# Altium schematic sheet RAM & MAR Circuit Electronic Scheme_2021-12-04.schdoc
size 910 x 236 mm
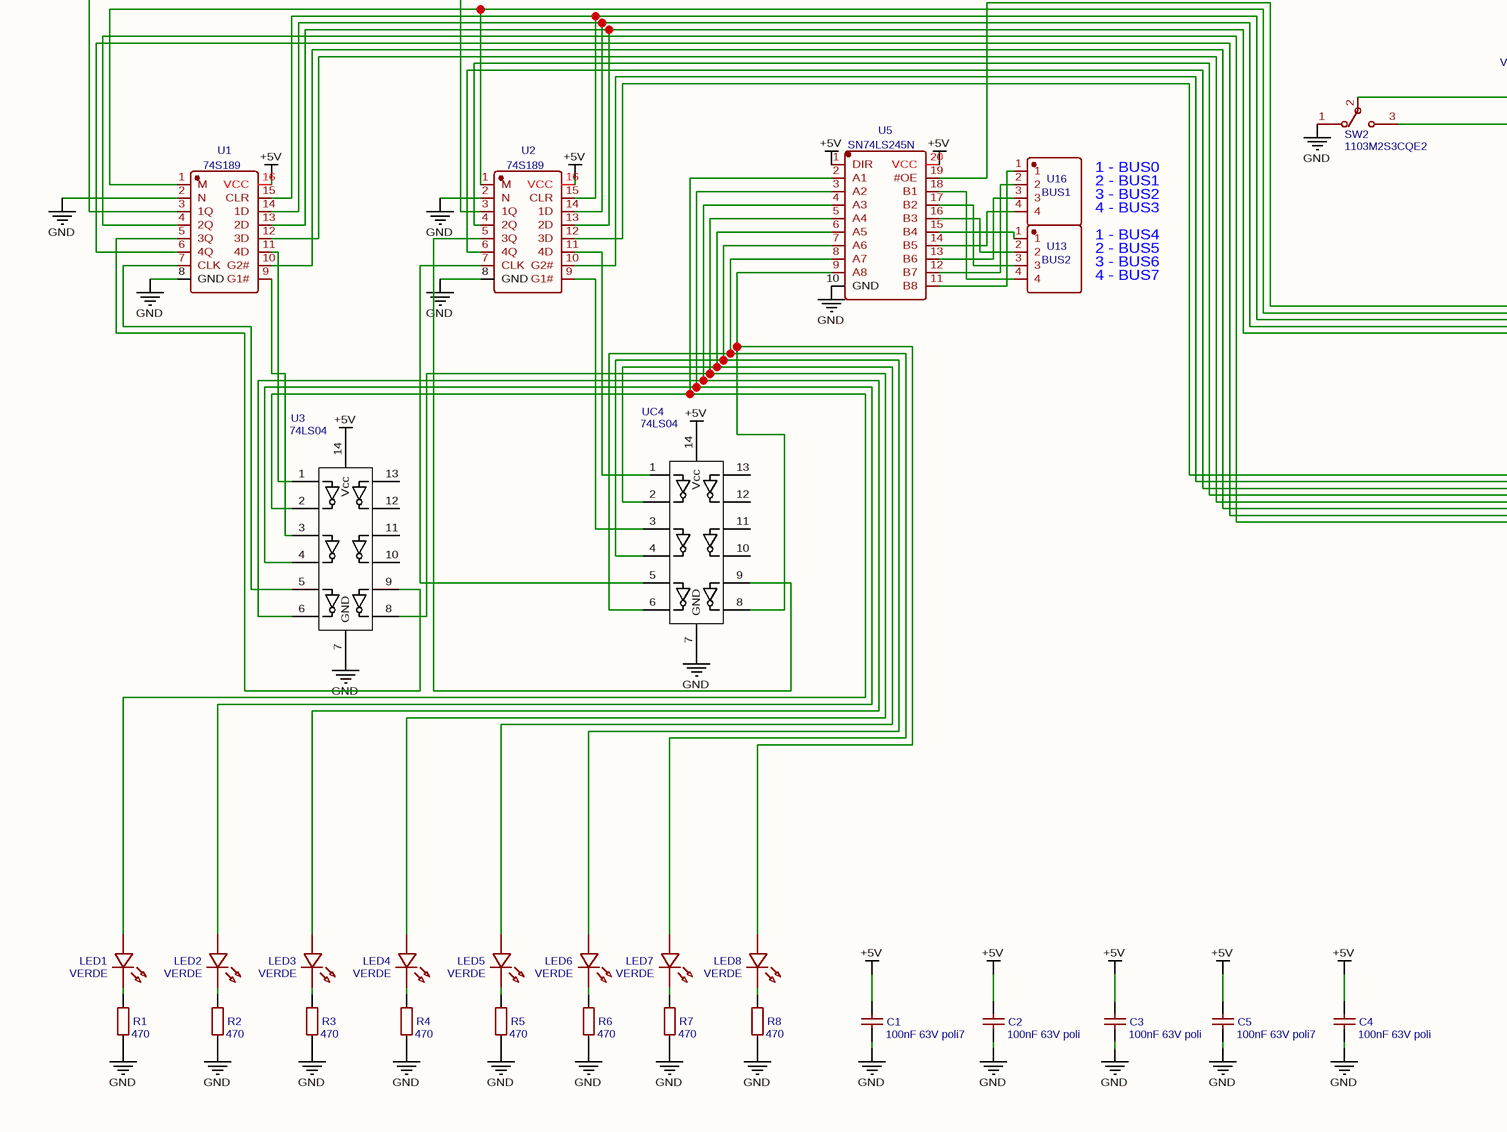
[diagram p0: RAM & MAR Circuit Electronic Scheme_2021-12-04.schdoc, left]
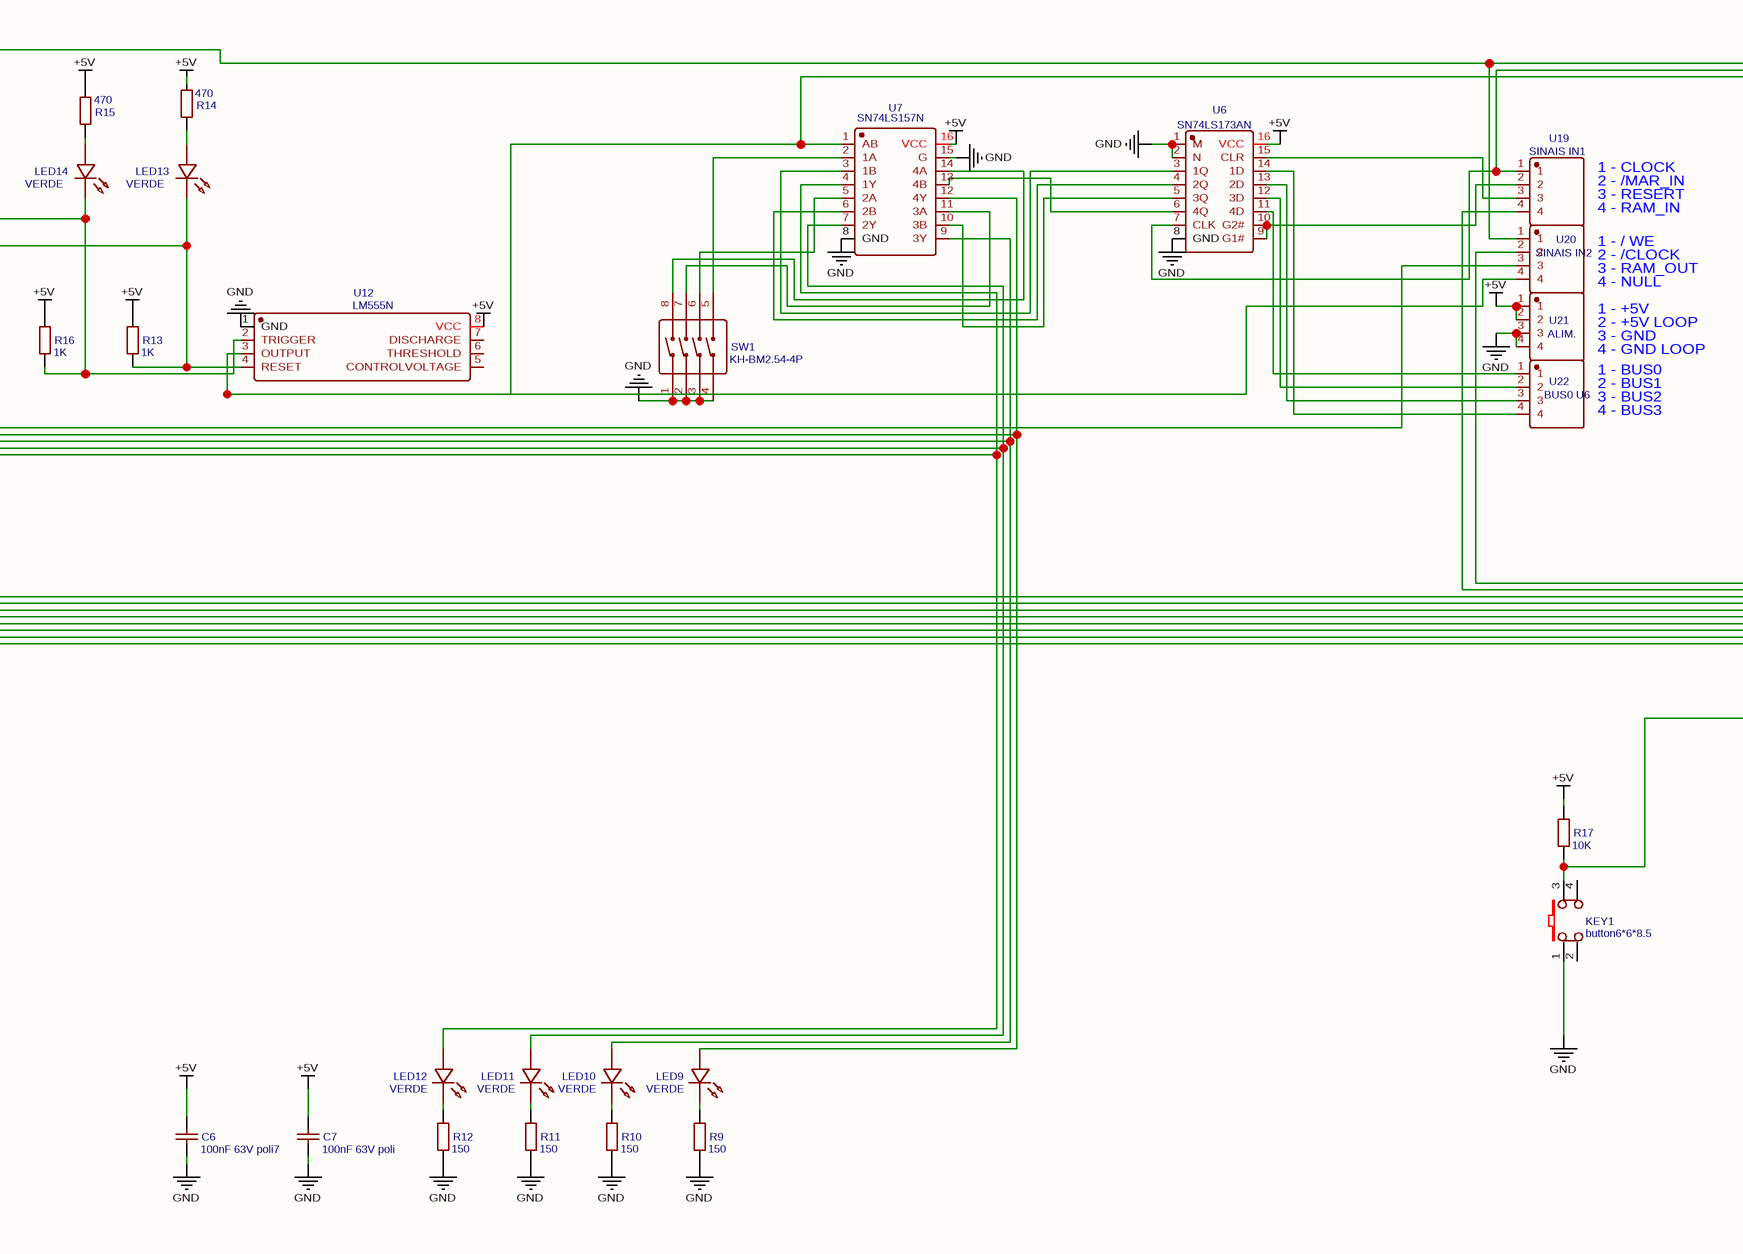
[diagram p1: RAM & MAR Circuit Electronic Scheme_2021-12-04.schdoc, middle]
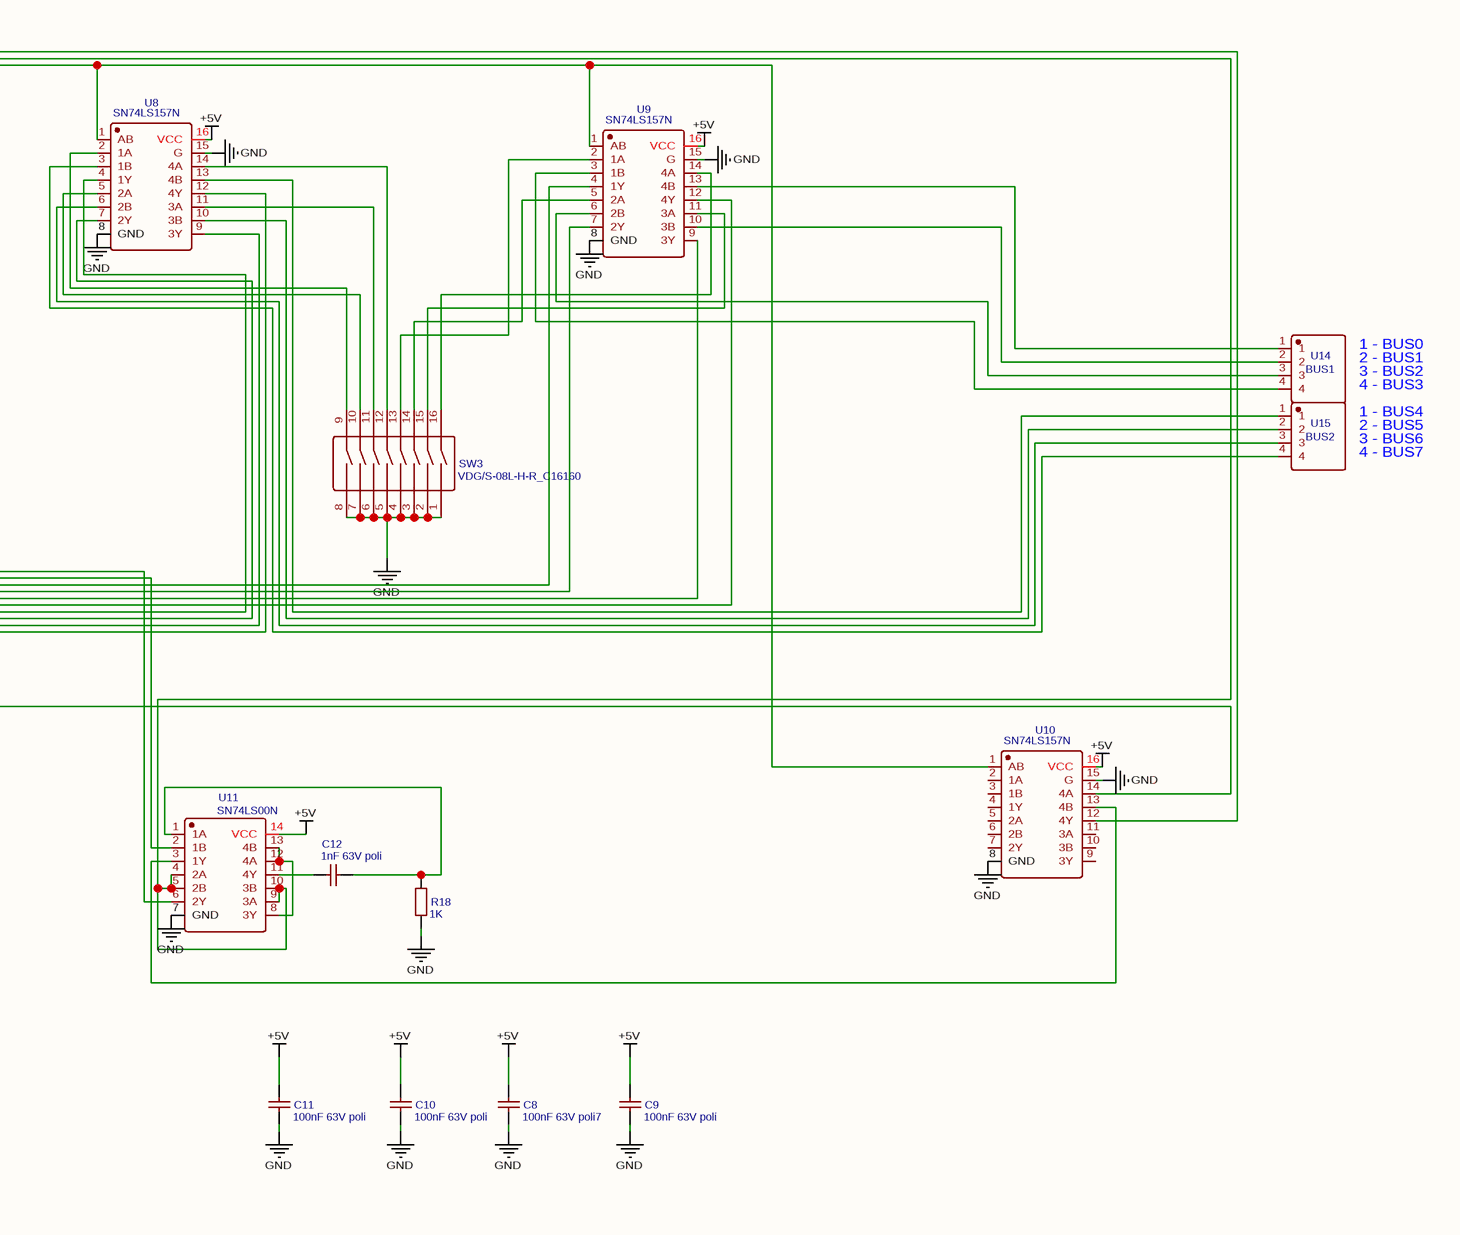
[diagram p2: RAM & MAR Circuit Electronic Scheme_2021-12-04.schdoc, right]

## Parts
C1  100nF 63V poli7  [CAP-TH_L7.6-W3.8-P5.08-D0.51]
C2  100nF 63V poli  [CAP-TH_L7.6-W3.8-P5.08-D0.51]
C3  100nF 63V poli  [CAP-TH_L7.6-W3.8-P5.08-D0.51]
C4  100nF 63V poli  [CAP-TH_L7.6-W3.8-P5.08-D0.51]
C5  100nF 63V poli7  [CAP-TH_L7.6-W3.8-P5.08-D0.51]
C6  100nF 63V poli7  [CAP-TH_L7.6-W3.8-P5.08-D0.51]
C7  100nF 63V poli  [CAP-TH_L7.6-W3.8-P5.08-D0.51]
C8  100nF 63V poli7  [CAP-TH_L7.6-W3.8-P5.08-D0.51]
C9  100nF 63V poli  [CAP-TH_L7.6-W3.8-P5.08-D0.51]
C10  100nF 63V poli  [CAP-TH_L7.6-W3.8-P5.08-D0.51]
C11  100nF 63V poli  [CAP-TH_L7.6-W3.8-P5.08-D0.51]
C12  1nF 63V poli  [CAP-TH_L7.6-W3.8-P5.08-D0.51]
KEY1  button6*6*8.5  [KEY-TH_4P-L6.0-W6.0-P4.50]
LED1  VERDE  [LED-TH_BD3.0-P2.54-RD-GREEN]
LED2  VERDE  [LED-TH_BD3.0-P2.54-RD-GREEN]
LED3  VERDE  [LED-TH_BD3.0-P2.54-RD-GREEN]
LED4  VERDE  [LED-TH_BD3.0-P2.54-RD-GREEN]
LED5  VERDE  [LED-TH_BD3.0-P2.54-RD-GREEN]
LED6  VERDE  [LED-TH_BD3.0-P2.54-RD-GREEN]
LED7  VERDE  [LED-TH_BD3.0-P2.54-RD-GREEN]
LED8  VERDE  [LED-TH_BD3.0-P2.54-RD-GREEN]
LED9  VERDE  [LED-TH_BD3.0-P2.54-RD-GREEN]
LED10  VERDE  [LED-TH_BD3.0-P2.54-RD-GREEN]
LED11  VERDE  [LED-TH_BD3.0-P2.54-RD-GREEN]
LED12  VERDE  [LED-TH_BD3.0-P2.54-RD-GREEN]
LED13  VERDE  [LED-TH_BD3.0-P2.54-RD-GREEN]
LED14  VERDE  [LED-TH_BD3.0-P2.54-RD-GREEN]
R1  470  [RES-TH_BD3.0-L9.5-P13.50-D0.6]
R2  470  [RES-TH_BD3.0-L9.5-P13.50-D0.6]
R3  470  [RES-TH_BD3.0-L9.5-P13.50-D0.6]
R4  470  [RES-TH_BD3.0-L9.5-P13.50-D0.6]
R5  470  [RES-TH_BD3.0-L9.5-P13.50-D0.6]
R6  470  [RES-TH_BD3.0-L9.5-P13.50-D0.6]
R7  470  [RES-TH_BD3.0-L9.5-P13.50-D0.6]
R8  470  [RES-TH_BD3.0-L9.5-P13.50-D0.6]
R9  150  [RES-TH_BD3.0-L9.5-P13.50-D0.6]
R10  150  [RES-TH_BD3.0-L9.5-P13.50-D0.6]
R11  150  [RES-TH_BD3.0-L9.5-P13.50-D0.6]
R12  150  [RES-TH_BD3.0-L9.5-P13.50-D0.6]
R13  1K  [RES-TH_BD3.0-L9.5-P13.50-D0.6]
R14  470  [RES-TH_BD3.0-L9.5-P13.50-D0.6]
R15  470  [RES-TH_BD3.0-L9.5-P13.50-D0.6]
R16  1K  [RES-TH_BD3.0-L9.5-P13.50-D0.6]
R17  10K  [RES-TH_BD3.0-L9.5-P13.50-D0.6]
R18  1K  [RES-TH_BD3.0-L9.5-P13.50-D0.6]
SW1  KH-BM2.54-4P  [SW-TH_KH-BM2.54-4P]
SW2  1103M2S3CQE2  [SW-TH_1103M2S3CQE2]
SW3  VDG/S-08L-H-R_C16160  [SW-TH_VDG-08LG-R]
U1  74S189  [PDIP-16_L19.7-W6.6-P2.54-LS7.6-BL]
U2  74S189  [PDIP-16_L19.7-W6.6-P2.54-LS7.6-BL]
U3  74LS04  [DIL-14]
U5  SN74LS245N  [DIP-20_L25.5-W10.0-P2.54-LS7.6-BL]
U6  SN74LS173AN  [PDIP-16_L19.7-W6.6-P2.54-LS7.6-BL]
U7  SN74LS157N  [DIP-16_16P-L20.2-W6.6-P2.54-LS7.6-BL]
U8  SN74LS157N  [DIP-16_16P-L20.2-W6.6-P2.54-LS7.6-BL]
U9  SN74LS157N  [DIP-16_16P-L20.2-W6.6-P2.54-LS7.6-BL]
U10  SN74LS157N  [DIP-16_16P-L20.2-W6.6-P2.54-LS7.6-BL]
U11  SN74LS00N  [PDIP-14_L19.7-W6.6-P2.54-LS8.3-BL]
U12  LM555N  [DIP-8_L9.7-W6.4-P2.54-LS7.6-BL]
U13  BUS2  [HDR-TH_4P-P2.54-D1.0]
U14  BUS1  [HDR-TH_4P-P2.54-D1.0]
U15  BUS2  [HDR-TH_4P-P2.54-D1.0]
U16  BUS1  [HDR-TH_4P-P2.54-D1.0]
U19  SINAIS IN1  [HDR-TH_4P-P2.54-D1.0]
U20  SINAIS IN2  [HDR-TH_4P-P2.54-D1.0]
U21  ALIM.  [HDR-TH_4P-P2.54-D1.0]
U22  BUS0 U6  [HDR-TH_4P-P2.54-D1.0]
UC4  74LS04  [DIL-14]

## Nets
+5V: C1.1 C2.1 C3.1 C4.1 C5.1 C6.1 C7.1 C8.1 C9.1 C10.1 C11.1 R13.1 R14.2 R15.2 R16.1 R17.1 U1.16(VCC) U2.16(VCC) U3.14(Vcc) U5.1(DIR) U5.20(VCC) U6.16(VCC) U7.16(VCC) U8.16(VCC) U9.16(VCC) U10.16(VCC) U11.14(VCC) U12.8(VCC) U21.1 U21.2 UC4.14(Vcc)
GND: C1.2 C2.2 C3.2 C4.2 C5.2 C6.2 C7.2 C8.2 C9.2 C10.2 C11.2 KEY1.1 R1.2 R2.2 R3.2 R4.2 R5.2 R6.2 R7.2 R8.2 R9.2 R10.2 R11.2 R12.2 R18.2 SW1.1 SW1.2 SW1.3 SW1.4 SW2.1 SW3.1 SW3.2 SW3.3 SW3.4 SW3.5 SW3.6 SW3.7 SW3.8 U1.2(N) U1.8(GND) U2.2(N) U2.8(GND) U3.7(GND) U5.10(GND) U6.1(M) U6.2(N) U6.8(GND) U7.8(GND) U7.15(G) U8.8(GND) U8.15(G) U9.8(GND) U9.15(G) U10.8(GND) U10.15(G) U11.7(GND) U12.1(GND) U21.3 U21.4 UC4.7(GND)
NetC12_1: C12.1 U11.11(4Y)
NetC12_2: C12.2 R18.1 U11.1(1A)
NetKEY1_3: KEY1.3 R17.2 U10.14(4A)
NetLED1_1: LED1.1(-) R1.1
NetLED1_2: LED1.2(+) U3.2 U5.2(A1)
NetLED2_1: LED2.1(-) R2.1
NetLED2_2: LED2.2(+) U3.4 U5.3(A2)
NetLED3_1: LED3.1(-) R3.1
NetLED3_2: LED3.2(+) U3.6 U5.4(A3)
NetLED4_1: LED4.1(-) R4.1
NetLED4_2: LED4.2(+) U3.8 U5.5(A4)
NetLED5_1: LED5.1(-) R5.1
NetLED5_2: LED5.2(+) U5.6(A5) UC4.2
NetLED6_1: LED6.1(-) R6.1
NetLED6_2: LED6.2(+) U5.7(A6) UC4.4
NetLED7_1: LED7.1(-) R7.1
NetLED7_2: LED7.2(+) U5.8(A7) UC4.6
NetLED8_1: LED8.1(-) R8.1
NetLED8_2: LED8.2(+) U5.9(A8) UC4.8
NetLED9_1: LED9.1(-) R9.1
NetLED9_2: LED9.2(+) U1.1(M) U2.1(M) U7.12(4Y)
NetLED10_1: LED10.1(-) R10.1
NetLED10_2: LED10.2(+) U1.15(CLR) U2.15(CLR) U7.9(3Y)
NetLED11_1: LED11.1(-) R11.1
NetLED11_2: LED11.2(+) U1.14(1D) U2.14(1D) U7.7(2Y)
NetLED12_1: LED12.1(-) R12.1
NetLED12_2: LED12.2(+) U1.13(2D) U2.13(2D) U7.4(1Y)
NetLED13_1: LED13.1(-) R13.2 SW2.3 U12.4(RESET)
NetLED13_2: LED13.2(+) R14.1
NetLED14_1: LED14.1(-) R16.2 SW2.2 U12.2(TRIGGER)
NetLED14_2: LED14.2(+) R15.1
NetSW1_5: SW1.5 U7.2(1A)
NetSW1_6: SW1.6 U7.5(2A)
NetSW1_7: SW1.7 U7.11(3A)
NetSW1_8: SW1.8 U7.14(4A)
NetSW3_9: SW3.9 U8.2(1A)
NetSW3_10: SW3.10 U8.5(2A)
NetSW3_11: SW3.11 U8.11(3A)
NetSW3_12: SW3.12 U8.14(4A)
NetSW3_13: SW3.13 U9.2(1A)
NetSW3_14: SW3.14 U9.5(2A)
NetSW3_15: SW3.15 U9.11(3A)
NetSW3_16: SW3.16 U9.14(4A)
NetU1_3: U1.3(1Q) U2.3(1Q) U10.12(4Y) U20.1
NetU1_4: U1.4(2Q) U8.12(4Y)
NetU1_5: U1.5(3Q) U3.9
NetU1_6: U1.6(4Q) U8.9(3Y)
NetU1_7: U1.7(CLK) U3.5
NetU1_9: U1.9(G1#) U3.3
NetU1_10: U1.10(G2#) U8.7(2Y)
NetU1_11: U1.11(4D) U3.1
NetU1_12: U1.12(3D) U8.4(1Y)
NetU2_4: U2.4(2Q) U9.12(4Y)
NetU2_5: U2.5(3Q) UC4.9
NetU2_6: U2.6(4Q) U9.9(3Y)
NetU2_7: U2.7(CLK) UC4.5
NetU2_9: U2.9(G1#) UC4.3
NetU2_10: U2.10(G2#) U9.7(2Y)
NetU2_11: U2.11(4D) UC4.1
NetU2_12: U2.12(3D) U9.4(1Y)
NetU5_11: U5.11(B8) U16.1
NetU5_12: U5.12(B7) U16.2
NetU5_13: U5.13(B6) U16.3
NetU5_14: U5.14(B5) U16.4
NetU5_15: U5.15(B4) U13.1
NetU5_16: U5.16(B3) U13.2
NetU5_17: U5.17(B2) U13.3
NetU5_18: U5.18(B1) U13.4
NetU5_19: U5.19(#OE) U20.3
NetU6_3: U6.3(1Q) U7.3(1B)
NetU6_4: U6.4(2Q) U7.6(2B)
NetU6_5: U6.5(3Q) U7.10(3B)
NetU6_6: U6.6(4Q) U7.13(4B)
NetU6_7: U6.7(CLK) U11.4(2A) U11.5(2B) U11.9(3A) U11.10(3B) U19.1
NetU6_9: U6.9(G1#) U6.10(G2#) U19.2
NetU6_11: U6.11(4D) U22.1
NetU6_12: U6.12(3D) U22.2
NetU6_13: U6.13(2D) U22.3
NetU6_14: U6.14(1D) U22.4
NetU6_15: U6.15(CLR) U19.3
NetU7_1: U7.1(AB) U8.1(AB) U9.1(AB) U10.1(AB) U12.3(OUTPUT) U20.4
NetU8_3: U8.3(1B) U15.4
NetU8_6: U8.6(2B) U15.3
NetU8_10: U8.10(3B) U15.2
NetU8_13: U8.13(4B) U15.1
NetU9_3: U9.3(1B) U14.4
NetU9_6: U9.6(2B) U14.3
NetU9_10: U9.10(3B) U14.2
NetU9_13: U9.13(4B) U14.1
NetU10_13: U10.13(4B) U11.3(1Y)
NetU11_2: U11.2(1B) U19.4
NetU11_6: U11.6(2Y) U20.2
NetU11_8: U11.8(3Y) U11.12(4A) U11.13(4B)

Not connected (* = marked no-connect by the designer): KEY1 2 4; U3 10 11 12 13; U10 2(1A) 3(1B) 4(1Y) 5(2A) 6(2B) 7(2Y) 9(3Y) 10(3B) 11(3A); U12 5(CONTROLVOLTAGE) 6(THRESHOLD) 7(DISCHARGE); UC4 10 11 12 13

## Notes on the sheet
- 3 - RESERT
- 2 - /MAR_IN
- 1 - CLOCK
- 4 - RAM_IN
- 1 - / WE
- 2 - /CLOCK
- 4 - BUS3
- 3 - BUS2
- 1 - BUS0
- 2 - BUS1
- 1 - +5V
- 2 - +5V LOOP
- 3 - RAM_OUT
- 4 - NULL
- 2 - BUS5
- 1 - BUS4
- 3 - BUS6
- 4 - BUS7
- 3 - GND
- 4 - GND LOOP

## Library data of the parts
C1 C5 C6 C8 = 100nF 63V poli7: BOM_Manufacturer: AVX; BOM_Manufacturer Part: SR305C105KAR; nameAlias: Capacitance; Contributor: LCSC; BOM_Supplier: LCSC; BOM_Supplier Part: C444741; BOM_JLCPCB Part Class: Extended Part; spicePre: C; spiceSymbolName: SR305C105KAR
C2-C4 C7 C9-C11 = 100nF 63V poli: BOM_Manufacturer: AVX; BOM_Manufacturer Part: SR305C105KAR; nameAlias: Capacitance; Contributor: LCSC; BOM_Supplier: LCSC; BOM_Supplier Part: C444741; BOM_JLCPCB Part Class: Extended Part; spicePre: C; spiceSymbolName: SR305C105KAR
C12 = 1nF 63V poli: BOM_Manufacturer: AVX; BOM_Manufacturer Part: SR305C105KAR; nameAlias: Capacitance; Contributor: LCSC; BOM_Supplier: LCSC; BOM_Supplier Part: C444741; BOM_JLCPCB Part Class: Extended Part; spicePre: C; spiceSymbolName: SR305C105KAR
KEY1 = button6*6*8.5: BOM_Manufacturer: ReliaPro; BOM_Supplier Part: C59980; BOM_Supplier: LCSC; BOM_Manufacturer Part: button6*6*8.5; spicePre: K; spiceSymbolName: button6*6*8.5
LED1-LED14 = VERDE: BOM_Manufacturer: Everlight Elec; BOM_Manufacturer Part: 264-7GD; Contributor: LCSC; BOM_Supplier: LCSC; BOM_Supplier Part: C605465; BOM_JLCPCB Part Class: Extended Part; spicePre: L; spiceSymbolName: 264-7GD
R1-R8 R14 R15 = 470: BOM_Manufacturer Part: CFR02SJ0823A10; BOM_Manufacturer: UniOhm; nameAlias: Resistance (Ohms); BOM_Supplier: LCSC; BOM_Supplier Part: C69876; spicePre: R; spiceSymbolName: CFR02SJ0823A10
R9-R12 = 150: BOM_Manufacturer Part: CFR02SJ0823A10; BOM_Manufacturer: UniOhm; nameAlias: Resistance (Ohms); BOM_Supplier: LCSC; BOM_Supplier Part: C69876; spicePre: R; spiceSymbolName: CFR02SJ0823A10
R13 R16 R18 = 1K: BOM_Manufacturer Part: CFR02SJ0823A10; BOM_Manufacturer: UniOhm; nameAlias: Resistance (Ohms); BOM_Supplier: LCSC; BOM_Supplier Part: C69876; spicePre: R; spiceSymbolName: CFR02SJ0823A10
R17 = 10K: BOM_Manufacturer Part: CFR02SJ0823A10; BOM_Manufacturer: UniOhm; nameAlias: Resistance (Ohms); BOM_Supplier: LCSC; BOM_Supplier Part: C69876; spicePre: R; spiceSymbolName: CFR02SJ0823A10
SW1 = KH-BM2.54-4P: BOM_Manufacturer: kinghelm(金航标); Contributor: LCSC; BOM_Supplier: LCSC; BOM_Supplier Part: C962226; BOM_Manufacturer Part: KH-BM2.54-4P; BOM_JLCPCB Part Class: Extended Part; spicePre: S; spiceSymbolName: KH-BM2.54-4P
SW2 = 1103M2S3CQE2: BOM_Manufacturer: C&K; Contributor: LCSC; BOM_Supplier: LCSC; BOM_Supplier Part: C221539; BOM_Manufacturer Part: 1103M2S3CQE2; BOM_JLCPCB Part Class: Extended Part; spicePre: S; spiceSymbolName: 1103M2S3CQE2
SW3 = VDG/S-08L-H-R_C16160: BOM_Manufacturer: ReliaPro; BOM_Supplier: LCSC; BOM_Manufacturer Part: VDG/S-08L-H-R; BOM_Supplier Part: C16160; BOM_JLCPCB Part Class: Extended Part; spicePre: S; spiceSymbolName: VDG/S-08L-H-R_C16160
U1 U2 = 74S189: BOM_Manufacturer: TI(德州仪器); BOM_Manufacturer Part: SN74LS173AN; Contributor: LCSC; BOM_Supplier: LCSC; BOM_Supplier Part: C1550125; spicePre: U; spiceSymbolName: SN74LS173AN
U3 UC4 = 74LS04: Contributor: keyboardjunkie; spicePre: I; spiceSymbolName: DM74LS04N
U5 = SN74LS245N: BOM_Manufacturer: Texas Instruments; Contributor: LCSC; BOM_Supplier: LCSC; BOM_Supplier Part: C352966; BOM_Manufacturer Part: SN74LS245N; BOM_JLCPCB Part Class: Extended Part; spicePre: U; spiceSymbolName: SN74LS245N
U6 = SN74LS173AN: BOM_Manufacturer: TI(德州仪器); Contributor: LCSC; BOM_Supplier: LCSC; BOM_Supplier Part: C1550125; BOM_Manufacturer Part: SN74LS173AN; spicePre: U; spiceSymbolName: SN74LS173AN
U7-U10 = SN74LS157N: BOM_Manufacturer: TI; Contributor: LCSC; BOM_Supplier: LCSC; BOM_Manufacturer Part: SN74LS157N; BOM_Supplier Part: C139317; BOM_JLCPCB Part Class: Extended Part; spicePre: U; spiceSymbolName: SN74LS157N
U11 = SN74LS00N: BOM_Manufacturer: TI; Contributor: LCSC; BOM_Supplier: LCSC; BOM_Manufacturer Part: SN74LS00N; BOM_Supplier Part: C181629; BOM_JLCPCB Part Class: Extended Part; spicePre: U; spiceSymbolName: SN74LS00N
U12 = LM555N: BOM_Manufacturer: HGSEMI; Contributor: LCSC; BOM_Supplier: LCSC; BOM_Supplier Part: C725327; BOM_Manufacturer Part: LM555N; BOM_JLCPCB Part Class: Extended Part; spicePre: U; spiceSymbolName: LM555N
U13 U15 = BUS2: BOM_Manufacturer: TE Connectivity; BOM_Manufacturer Part: 171825-4; Contributor: LCSC; BOM_Supplier: LCSC; BOM_Supplier Part: C210162; BOM_JLCPCB Part Class: Extended Part; spicePre: U; spiceSymbolName: 171825-4
U14 U16 = BUS1: BOM_Manufacturer: TE Connectivity; BOM_Manufacturer Part: 171825-4; Contributor: LCSC; BOM_Supplier: LCSC; BOM_Supplier Part: C210162; BOM_JLCPCB Part Class: Extended Part; spicePre: U; spiceSymbolName: 171825-4
U19 = SINAIS IN1: BOM_Manufacturer: TE Connectivity; BOM_Manufacturer Part: 171825-4; Contributor: LCSC; BOM_Supplier: LCSC; BOM_Supplier Part: C210162; BOM_JLCPCB Part Class: Extended Part; spicePre: U; spiceSymbolName: 171825-4
U20 = SINAIS IN2: BOM_Manufacturer: TE Connectivity; BOM_Manufacturer Part: 171825-4; Contributor: LCSC; BOM_Supplier: LCSC; BOM_Supplier Part: C210162; BOM_JLCPCB Part Class: Extended Part; spicePre: U; spiceSymbolName: 171825-4
U21 = ALIM.: BOM_Manufacturer: TE Connectivity; BOM_Manufacturer Part: 171825-4; Contributor: LCSC; BOM_Supplier: LCSC; BOM_Supplier Part: C210162; BOM_JLCPCB Part Class: Extended Part; spicePre: U; spiceSymbolName: 171825-4
U22 = BUS0 U6: BOM_Manufacturer: TE Connectivity; BOM_Manufacturer Part: 171825-4; Contributor: LCSC; BOM_Supplier: LCSC; BOM_Supplier Part: C210162; BOM_JLCPCB Part Class: Extended Part; spicePre: U; spiceSymbolName: 171825-4